# Altium project sensor_board.PrjPcb
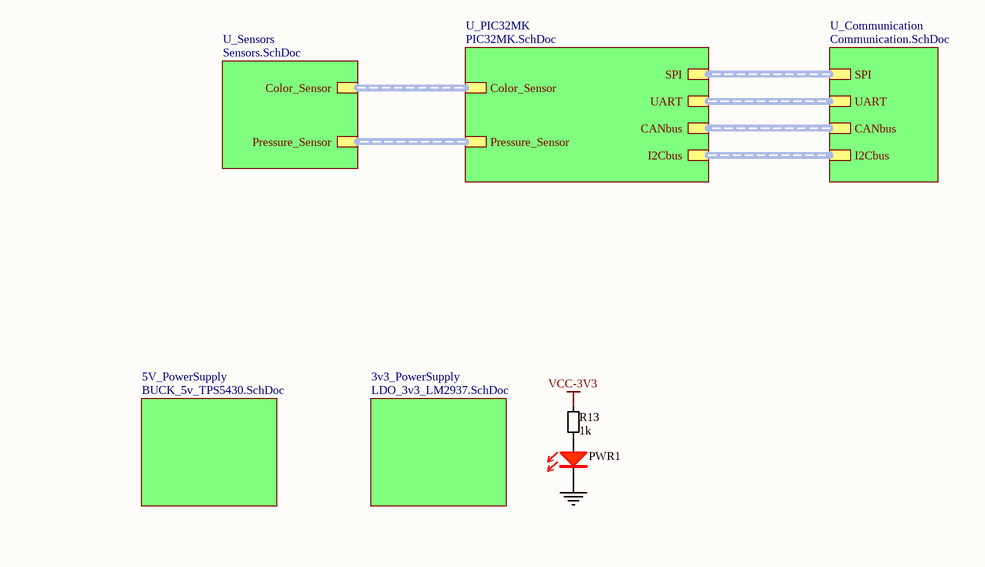
[diagram p0: SensorControl_Board_v3.1.SchDoc]
11 sheets, 107 parts. Net scope: hierarchical (ports join the sheet entries above them; power ports are global).
Board file: SensorControl_Board_v3.1.PcbDoc
Sheets:
  SensorControl_Board_v3.1.SchDoc
    5V_PowerSupply = BUCK_5v_TPS5430.SchDoc
    3v3_PowerSupply = LDO_3v3_LM2937.SchDoc
    U_Communication = Communication.SchDoc
      CANbus = CANbus.SchDoc
    U_Sensors = Sensors.SchDoc
      Col_Sens1 = Color_Sensor.SchDoc
      Col_Sens2 = Color_Sensor.SchDoc
      Col_Sens3 = Color_Sensor.SchDoc
      Col_Sens4 = Color_Sensor.SchDoc
      Col_Sens5 = Color_Sensor.SchDoc
      Pressure_Sensor1 = Pressure_Sensor.SchDoc
      Pressure_Sensor2 = Pressure_Sensor.SchDoc
      Pressure_Sensor3 = Pressure_Sensor.SchDoc
      Pressure_Sensor4 = Pressure_Sensor.SchDoc
      Pressure_Sensor5 = Pressure_Sensor.SchDoc
      Pressure_Sensor6 = Pressure_Sensor.SchDoc
      Pressure_Sensor7 = Pressure_Sensor.SchDoc
      Pressure_Sensor8 = Pressure_Sensor.SchDoc
      Pressure_Sensor9 = Pressure_Sensor.SchDoc
      Pressure_Sensor10 = Pressure_Sensor.SchDoc
    U_PIC32MK = PIC32MK.SchDoc
      Oscillator = 8MHz_Crystal.SchDoc
      RESET = MCLR_PIC.SchDoc

## Sheet SensorControl_Board_v3.1.SchDoc
size A

### Parts
PWR1  LED RED  [LED_RED_0805]  (value not drawn)
R13  1k  [RESC2013X38N-0805-NOOVERLAY]

### Sub-sheets
3v3_PowerSupply = LDO_3v3_LM2937.SchDoc: no entries
5V_PowerSupply = BUCK_5v_TPS5430.SchDoc: no entries
U_Communication = Communication.SchDoc: SPI (harness SPI), UART (harness UART), CANbus (harness CANbus), I2Cbus (harness I2Cbus)
U_PIC32MK = PIC32MK.SchDoc: Color_Sensor (harness Color_Sensor), Pressure_Sensor (harness Pressure_Sensor), SPI (harness SPI), UART (harness UART), CANbus (harness CANbus), I2Cbus (harness I2Cbus)
U_Sensors = Sensors.SchDoc: Color_Sensor (harness Color_Sensor), Pressure_Sensor (harness Pressure_Sensor)

### Nets
GND: PWR1.1(C)
VCC-3V3: R13.2
NetPWR1_2: PWR1.2(A) R13.1

### Buses and harness runs
harness sheet U_Communication/CANbus = sheet U_PIC32MK/CANbus
harness sheet U_Communication/I2Cbus = sheet U_PIC32MK/I2Cbus
harness sheet U_Communication/SPI = sheet U_PIC32MK/SPI
harness sheet U_Communication/UART = sheet U_PIC32MK/UART
harness sheet U_PIC32MK/Color_Sensor = sheet U_Sensors/Color_Sensor
harness sheet U_PIC32MK/Pressure_Sensor = sheet U_Sensors/Pressure_Sensor

### Library data of the parts
PWR1 = LED_RED_0805: LED RED 0805; Manufacturer: BRIGHT LED ELECTRONICS; Manufacturer Part Number: BL-HUB35A-AV-TRB; Barcode: 2911010024321; id: 35; Assembly: SMD; Voltage Forward: 2.0 V; item_id: 3341; Recommended Rating: Platinum; Package Case: 0805 (2012 Metric); Color: Red; Family: LED; Part Type: Optoelectronics
R13 = 00001001: RES SMD 1 kOhm 1/8W 0805; Power: 0.125W, 1/8W; Barcode: 00009101; Resistance: 1k; Assembly: SMD

## Sheet BUCK_5v_TPS5430.SchDoc: Memristor Power 5.0
size A4; Author: Nikola Rašević; Organization: Memristor-Robotics; Address1: Vladimira Perića Valtera 2; Address2: 21000 Novi Sad; Address3: Serbia; Revision: v1
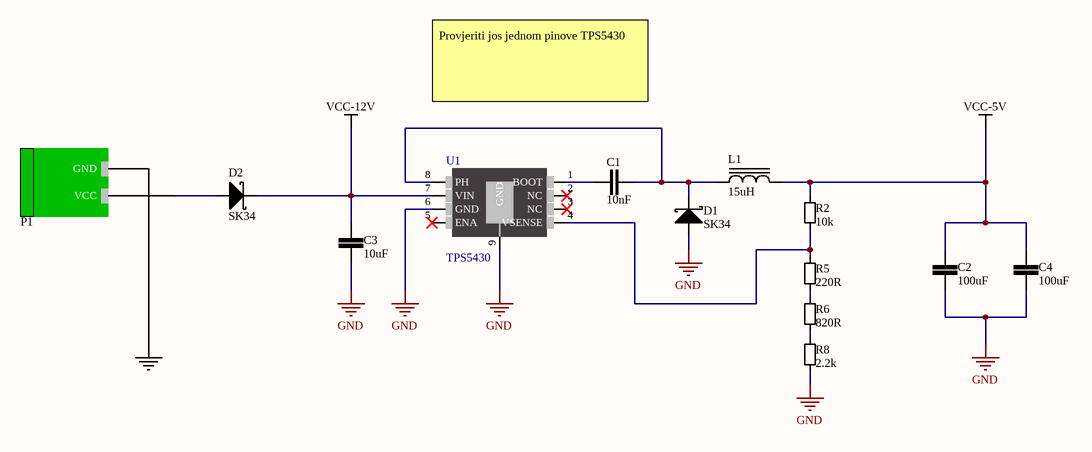
[diagram p1: BUCK_5v_TPS5430.SchDoc]

### Parts
C1  10nF  [CER_0805]
C2  100uF  [CER_1210]
C3  10uF  [CER_0805]
C4  100uF  [CER_1210]
D1  SK34  [DO214AC]
D2  SK34  [DO214AC]
L1  15uH  [INDUCTOR_SS1260-103MLD]
P1  2EDGRC-5.08-02P-14-00A(H)  [PWR_Con]  (value not drawn)
R2  10k  [RESC2013X38N-0805-NOOVERLAY]
R5  220R  [RESC2013X38N-0805-NOOVERLAY]
R6  820R  [RESC2013X38N-0805-NOOVERLAY]
R8  2.2k  [RESC2013X38N-0805-NOOVERLAY]
U1  TPS5430  [HSOP-8]

### Nets
GND: C2.1 C3.1 C4.1 D1.2(Anode) P1.1(GND) R8.1 U1.6(GND) U1.9(GND)
VCC-5V: C2.2 C4.2 L1.2 R2.2
VCC-12V: C3.2 D2.1(Cathode) U1.7(VIN)
NetC1_1: C1.1 U1.1(BOOT)
NetC1_2: C1.2 D1.1(Cathode) L1.1 U1.8(PH)
NetD2_2: D2.2(Anode) P1.2(VCC)
NetR2_1: R2.1 R5.2 U1.4(VSENSE)
NetR5_1: R5.1 R6.2
NetR6_1: R6.1 R8.2

Not connected (* = marked no-connect by the designer): U1 2(NC)* 3(NC)* 5(ENA)*

### Notes on the sheet
- Provjeriti jos jednom pinove TPS5430
- Title
- Date:
- Design Engineer:
- Time:
- Revision:
- Sheet
- of
- Size:
- A4
- www.memristor-robotics.io
- File:

### Library data of the parts
C1 = CER 10n 50V X7R: CAP CER 10n 50V X7R 10% 0805; Capacitance: 10nF; LCSC Part #: C1710
C2 C4 = 00002108: CAP CER 100u X5R 6.3V 10% 1210; Capacitance: 100uF
C3 = CER 10u 25V X5R: CAP CER 10u 25V X5R 10% 0805; Capacitance: 10uF; LCSC Part #: C15850
D1 D2 = SK34: DIODE SCHOTTKY 40V 3A DO214AC; Manufacturer: Vishay Semiconductor Diodes Division; Barcode: 0100000007488; id: 62; Assembly: SMD; Speed: Fast Recovery =< 500ns, > 200mA (Io); Voltage  Forward: 550mV @ 3A; item_id: 1025; Recommended Rating: Silver; Manufacturer Part Number: SK34; Category: Discrete Semiconductor Products; Datasheet URL: http://www.vishay.com/docs/88896/b330la.pdf; Package Case: DO-214AC, SMA; Family: DIODE; Voltage  DC Reverse: 40V; Current  Average Rectified: 3A; Diode Type: Schottky; Part Type: Discrete Semiconductors
L1 = IND_15uH: FIXED IND 15uH 3A; Assembly: SMD; Category: Inductors, Coils, Chokes; Inductance: 15uH; Current Rating: 3A; Family: INDUCTOR
P1 = 00000002: TERM BLOCK HDR 2POS 90DEG 5.08MM; Suplier: TME; Manufacturer Part Number: 2EDGRC-5.08-02P-14-00A(H); Suplier Product Link: https://www.tme.eu/en/details/2edgrc5.08-2p14/pluggable-terminal-blocks/degson-electronics/2edgrc-508-02p-14-00ah/; Price: 0.1304
R2 = 000001002: RES SMD 10 kOhm 1/8W 0805; Resistance: 10k
R5 = RES SMD 220 Ohm 0805: RES SMD 220 Ohm 1/8W 0805; Resistance: 220R; LCSC Part #: C17557
R6 = RES SMD 820 Ohm 0805: RES SMD 820 Ohm 1/8W 0805; Resistance: 820R; LCSC Part #: C17837
R8 = RES SMD 2.2 kOhm 0805: RES SMD 2.2 kOhm 1/8W 0805; Resistance: 2.2k; LCSC Part #: C17520
U1 = TPS5430: IC REG BUCK ADJ 3A 8SOPWRPAD; Manufacturer Part Number: TPS5430; LCSC Part #: C9864

## Sheet LDO_3v3_LM2937.SchDoc: 3v3 LDO Module
size A4; Author: Nikola Raševiæ; Organization: Memristor Robotics; SheetNumber: 2; SheetTotal: 11
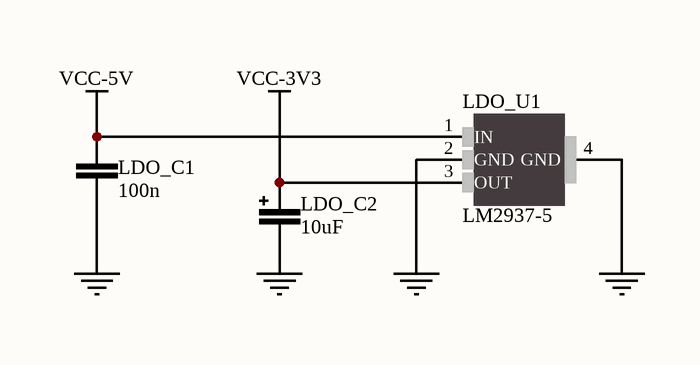
[diagram p2: LDO_3v3_LM2937.SchDoc]

### Parts
LDO_C1  100n  [CER_0603]
LDO_C2  10uF  [TANT_1210]
LDO_U1  LM2937-5  [SOT223]

### Nets
GND: LDO_C1.1 LDO_C2.2 LDO_U1.2(GND) LDO_U1.4(GND)
VCC-3V3: LDO_C2.1 LDO_U1.3(OUT)
VCC-5V: LDO_C1.2 LDO_U1.1(IN)

### Notes on the sheet
- Title
- Date:
- Design Engineer:
- Time:
- Revision:
- Sheet
- of
- Size:
- A4
- www.memristor-robotics.io
- File:

### Library data of the parts
LDO_C1 = 06032105: CAP CER 100n 10V X5R 10% 0603; Capacitance: 100n
LDO_C2 = 00001106: CAP TANT 10u; Value: 10uF
LDO_U1 = LM2937: IC REG LINEAR 5V 400MA SOT223-4; Manufacturer Part Number: LM2937-5; Datasheet Link: http://www.ti.com/lit/ds/symlink/lm2937.pdf

## Sheet Communication.SchDoc
size A4
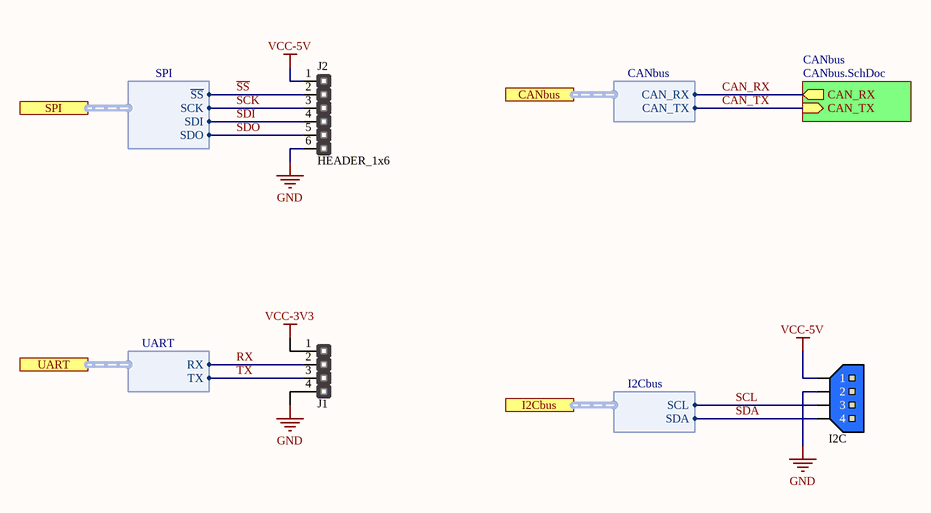
[diagram p3: Communication.SchDoc]

### Parts
I2C  TE CONNECTIVITY_4PIN_MALE  [TE CONNECTIVITY_4PIN_MALE]  (value not drawn)
J1  HEADER_1x4  [HM1X4]  (value not drawn)
J2  HEADER_1x6  [HM1X6]

### Sub-sheets
CANbus = CANbus.SchDoc: CAN_TX (in), CAN_RX (out)

### Ports
CANbus (harness CANbus), I2Cbus (harness I2Cbus), SPI (harness SPI), UART (harness UART)

### Harnesses
SPI: ~{SS}, SCK, SDI, SDO
UART: RX, TX
CANbus: CAN_RX, CAN_TX
I2Cbus: SCL, SDA

### Nets
GND: I2C.2 J1.4 J2.6
VCC-3V3: J1.1
VCC-5V: I2C.1 J2.1
CAN_RX: sheet CANbus/CAN_RX, port CANbus.CAN_RX
CAN_TX: sheet CANbus/CAN_TX, port CANbus.CAN_TX
RX: J1.2 ; port UART.RX
~{SS}: J2.2 ; port SPI.~{SS}
SCK: J2.3 ; port SPI.SCK
SCL: I2C.3 ; port I2Cbus.SCL
SDA: I2C.4 ; port I2Cbus.SDA
SDI: J2.4 ; port SPI.SDI
SDO: J2.5 ; port SPI.SDO
TX: J1.3 ; port UART.TX

### Library data of the parts
I2C = TE CONNECTIVITY_4PIN_MALE: BLUE_4PIN_CONECTOR; Manufacturer: TE CONNECTIVITY / AMP; Manufacturer Part Number 1: 281695-3; Order Code 1: 1205983; Price 1: L0.403; Supplier 1: uk.farnell.com

## Sheet CANbus.SchDoc: CANbus Module
size A4; Author: Nikola Rašević; Organization: Memristor Robotics
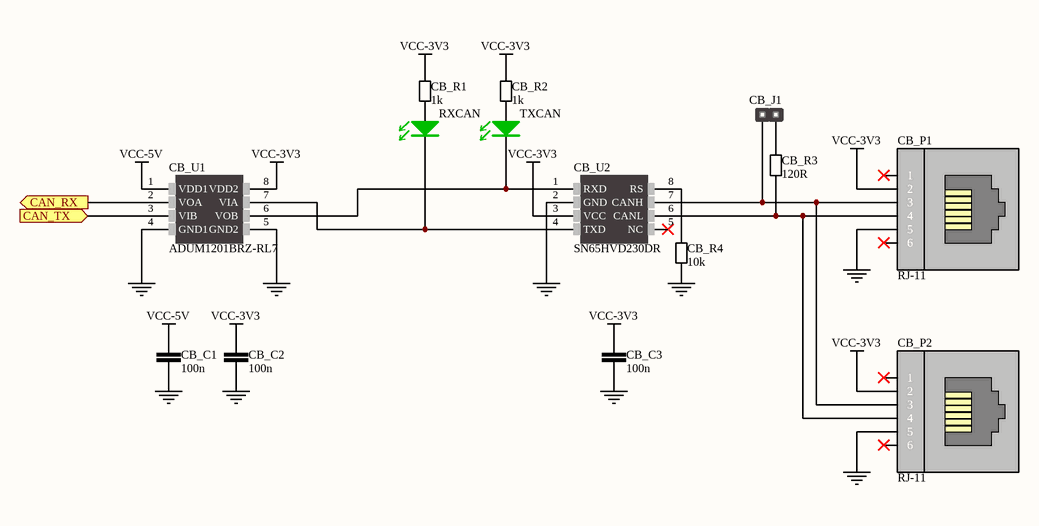
[diagram p4: CANbus.SchDoc]

### Parts
CB_C1  100n  [CER_0603]
CB_C2  100n  [CER_0603]
CB_C3  100n  [CER_0603]
CB_J1  *  [HM1x2]  (value not drawn)
CB_P1  RJ-11  [RJ11-6N-B]
CB_P2  RJ-11  [RJ11-6N-B]
CB_R1  1k  [RESC2013X38N-0805-NOOVERLAY]
CB_R2  1k  [RESC2013X38N-0805-NOOVERLAY]
CB_R3  120R  [RESC2013X38N-0805-NOOVERLAY]
CB_R4  10k  [RESC2013X38N-0805-NOOVERLAY]
CB_U1  ADUM1201BRZ-RL7  [SOIC-8]
CB_U2  SN65HVD230DR  [SOIC-8]
RXCAN  LED GREEN  [LED_GREEN_0805]  (value not drawn)
TXCAN  LED GREEN  [LED_GREEN_0805]  (value not drawn)

### Ports
CAN_RX (out), CAN_TX (in)

### Nets
GND: CB_C1.1 CB_C2.1 CB_C3.1 CB_P1.5 CB_P2.5 CB_R4.1 CB_U1.4(GND1) CB_U1.5(GND2) CB_U2.2(GND)
VCC-3V3: CB_C2.2 CB_C3.2 CB_P1.2 CB_P2.2 CB_R1.2 CB_R2.2 CB_U1.8(VDD2) CB_U2.3(VCC)
VCC-5V: CB_C1.2 CB_U1.1(VDD1)
CAN_RX: CB_U1.2(VOA) ; port CAN_RX
CAN_TX: CB_U1.3(VIB) ; port CAN_TX
NetCB_J1_1: CB_J1.1 CB_P1.3 CB_P2.3 CB_U2.7(CANH)
NetCB_J1_2: CB_J1.2 CB_R3.2
NetCB_P1_4: CB_P1.4 CB_P2.4 CB_R3.1 CB_U2.6(CANL)
NetCB_R1_1: CB_R1.1 RXCAN.2(A)
NetCB_R2_1: CB_R2.1 TXCAN.2(A)
NetCB_R4_2: CB_R4.2 CB_U2.8(RS)
NetCB_U1_6: CB_U1.6(VOB) CB_U2.1(RXD) TXCAN.1(C)
NetCB_U1_7: CB_U1.7(VIA) CB_U2.4(TXD) RXCAN.1(C)

Not connected (* = marked no-connect by the designer): CB_P1 1* 6*; CB_P2 1* 6*; CB_U2 5(NC)*

### Notes on the sheet
- Title
- Date:
- Design Engineer:
- Time:
- Revision:
- Sheet
- of
- Size:
- A4
- www.memristor-robotics.io
- File:

### Library data of the parts
CB_C1-CB_C3 = 06032105: CAP CER 100n 10V X5R 10% 0603; Capacitance: 100n
CB_J1 = HEADER_1x2: Manufacturer Part Number: *
CB_P1 CB_P2 = 00000001: Manufacturer Part Number: RJ-11
CB_R1 CB_R2 = 00001001: as R13 on sheet SensorControl_Board_v3.1; Resistance: 1k; Assembly: SMD
CB_R3 = 000001200: RES SMD 120 Ohm 1/8W 0805; Resistance: 120R
CB_R4 = 000001002: RES SMD 10 kOhm 1/8W 0805; Resistance: 10k
CB_U1 = ADUM1201BRZ: DGTL ISO 2.5KV GEN PURP 8SOIC; Assembly: SMD; Barcode: 00000001; Manufacturer Part Number: ADUM1201BRZ-RL7; Datasheet Link: http://www.analog.com/media/en/technical-documentation/data-sheets/ADuM1200_1201.pdf; Category: Integrated Circuits (ICs); Package: SOIC-8; Family: Comunication
CB_U2 = SN65HVD230: IC EMC CAN TRANSCEIVER 8-SOIC; Assembly: SMD; Barcode: 00000001; Manufacturer Part Number: SN65HVD230DR; Comet Product Page: http://store.comet.rs/Catalogue/Product/9057/; Datasheet Link: http://www.ti.com/lit/ds/symlink/sn65hvd232.pdf; Category: Integrated Circuits (ICs); Package: SOIC-8; Family: Comunication
RXCAN TXCAN = LED_GREEN 0805: LED GREEN CLEAR 0805 SMD; Manufacturer: Kingbright; Manufacturer Part Number: APT2012SGC; Barcode: 2911010024338; id: 28; Voltage Forward: 2.2V; Wavelength: 568nm; Lens Color: Colorless; item_id: 3342; Recommended Rating: Platinum; Category: Optoelectronics; Assembly: SMD; Datasheet URL: http://www.kingbrightusa.com/images/catalog/SPEC/APT2012SGC.pdf; Package Case: 0805 (2012 Metric); Color: Green; Family: LED; Lens Transparency: Clear; Part Type: Optoelectronics

## Sheet Sensors.SchDoc
size A4
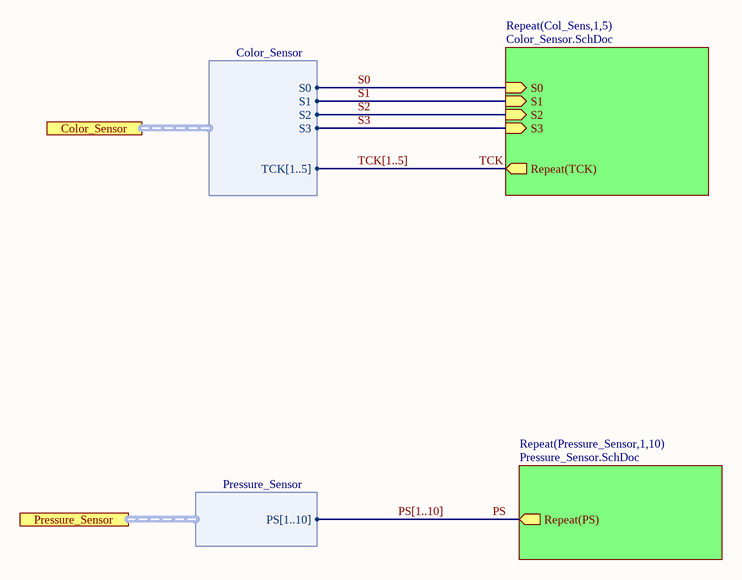
[diagram p5: Sensors.SchDoc]

### Sub-sheets
Repeat(Col_Sens,1,5) = Color_Sensor.SchDoc: S0 (in), S1 (in), S2 (in), S3 (in), Repeat(TCK) (out)
Repeat(Pressure_Sensor,1,10) = Pressure_Sensor.SchDoc: Repeat(PS) (out)

### Ports
Color_Sensor (harness Color_Sensor), Pressure_Sensor (harness Pressure_Sensor)

### Harnesses
Color_Sensor: TCK[1..5], S0, S1, S2, S3
Pressure_Sensor: PS[1..10]

### Nets
PS: sheet Repeat(Pressure_Sensor,1,10)/Repeat(PS)
S0: sheet Repeat(Col_Sens,1,5)/S0, port Color_Sensor.S0
S1: sheet Repeat(Col_Sens,1,5)/S1, port Color_Sensor.S1
S2: sheet Repeat(Col_Sens,1,5)/S2, port Color_Sensor.S2
S3: sheet Repeat(Col_Sens,1,5)/S3, port Color_Sensor.S3
TCK: sheet Repeat(Col_Sens,1,5)/Repeat(TCK)

### Buses and harness runs
bus PS[1..10]
bus TCK[1..5]

## Sheet Color_Sensor.SchDoc
size A
Used 5 times, as channels U_Sensors/Col_Sens1, U_Sensors/Col_Sens2, U_Sensors/Col_Sens3, U_Sensors/Col_Sens4, U_Sensors/Col_Sens5. Parts and nets are listed once, with the designators drawn on the sheet.
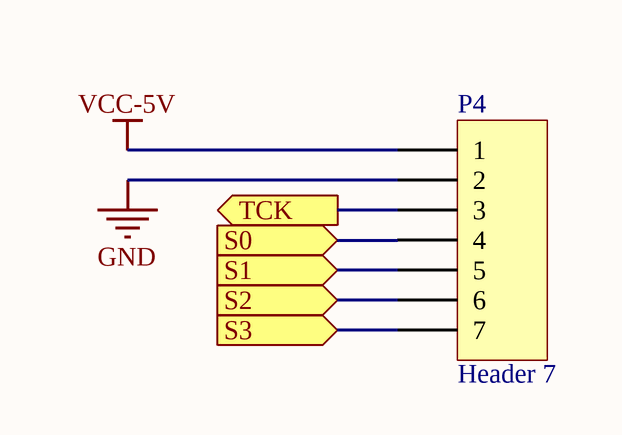
[diagram p6: Color_Sensor.SchDoc]

### Parts
P4  Header 7  [HDR1X7]

### Ports
S0 (in), S1 (in), S2 (in), S3 (in), TCK (out)

### Nets
GND: P4.2
VCC-5V: P4.1
S0: P4.4 ; port S0
S1: P4.5 ; port S1
S2: P4.6 ; port S2
S3: P4.7 ; port S3
TCK: P4.3 ; port TCK

### Channels
U_Sensors/Col_Sens1: designators end in _Col_Sens1; ports S0=S0 S1=S1 S2=S2 S3=S3 TCK=TCK1
U_Sensors/Col_Sens2: designators end in _Col_Sens2; ports S0=S0 S1=S1 S2=S2 S3=S3 TCK=TCK2
U_Sensors/Col_Sens3: designators end in _Col_Sens3; ports S0=S0 S1=S1 S2=S2 S3=S3 TCK=TCK3
U_Sensors/Col_Sens4: designators end in _Col_Sens4; ports S0=S0 S1=S1 S2=S2 S3=S3 TCK=TCK4
U_Sensors/Col_Sens5: designators end in _Col_Sens5; ports S0=S0 S1=S1 S2=S2 S3=S3 TCK=TCK5

### Library data of the parts
P4 = Header 7: Header, 7-Pin; LatestRevisionDate: 17-Jul-2002; LatestRevisionNote: Re-released for DXP Platform.; Publisher: Altium Limited

## Sheet Pressure_Sensor.SchDoc
size A4; SheetNumber: 11; SheetTotal: 11
Used 10 times, as channels U_Sensors/Pressure_Sensor1, U_Sensors/Pressure_Sensor2, U_Sensors/Pressure_Sensor3, U_Sensors/Pressure_Sensor4, U_Sensors/Pressure_Sensor5, U_Sensors/Pressure_Sensor6, U_Sensors/Pressure_Sensor7, U_Sensors/Pressure_Sensor8, U_Sensors/Pressure_Sensor9, U_Sensors/Pressure_Sensor10. Parts and nets are listed once, with the designators drawn on the sheet.
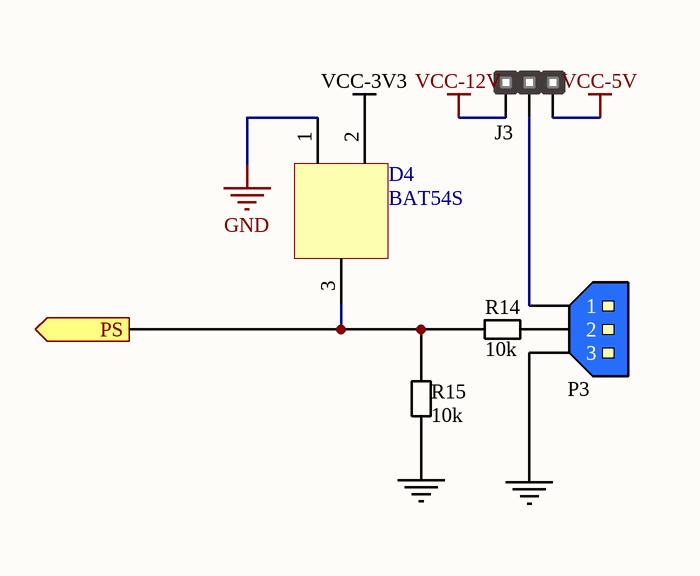
[diagram p7: Pressure_Sensor.SchDoc]

### Parts
D4  BAT54S  [BAT54S]
J3  *  [HM1X3]  (value not drawn)
P3  TE CONNECTIVITY_3PIN_MALE  [TE CONNECTIVITY_3PIN_MALE]  (value not drawn)
R14  10k  [RESC2013X38N-0805-NOOVERLAY]
R15  10k  [RESC2013X38N-0805-NOOVERLAY]

### Ports
PS (out)

### Nets
GND: D4.1 P3.3 R15.1
VCC-3V3: D4.2
VCC-5V: J3.3
VCC-12V: J3.1
PS: D4.3 R14.2 R15.2 ; port PS
NetJ3_2: J3.2 P3.1
NetP3_2: P3.2 R14.1

### Channels
U_Sensors/Pressure_Sensor1: designators end in _Pressure_Sensor1; ports PS=PS1
U_Sensors/Pressure_Sensor2: designators end in _Pressure_Sensor2; ports PS=PS2
U_Sensors/Pressure_Sensor3: designators end in _Pressure_Sensor3; ports PS=PS3
U_Sensors/Pressure_Sensor4: designators end in _Pressure_Sensor4; ports PS=PS4
U_Sensors/Pressure_Sensor5: designators end in _Pressure_Sensor5; ports PS=PS5
U_Sensors/Pressure_Sensor6: designators end in _Pressure_Sensor6; ports PS=PS6
U_Sensors/Pressure_Sensor7: designators end in _Pressure_Sensor7; ports PS=PS7
U_Sensors/Pressure_Sensor8: designators end in _Pressure_Sensor8; ports PS=PS8
U_Sensors/Pressure_Sensor9: designators end in _Pressure_Sensor9; ports PS=PS9
U_Sensors/Pressure_Sensor10: designators end in _Pressure_Sensor10; ports PS=PS10

### Library data of the parts
J3 = HEADER_1x3: Manufacturer Part Number: *
P3 = TE CONNECTIVITY_3PIN_MALE: BLUE_3PIN_CONECTOR; Manufacturer: TE CONNECTIVITY / AMP; Manufacturer Part Number 1: 281695-3; Order Code 1: 1205983; Price 1: £0.403; Supplier 1: uk.farnell.com
R14 R15 = 000001002: RES SMD 10 kOhm 1/8W 0805; Resistance: 10k

## Sheet PIC32MK.SchDoc
size A3
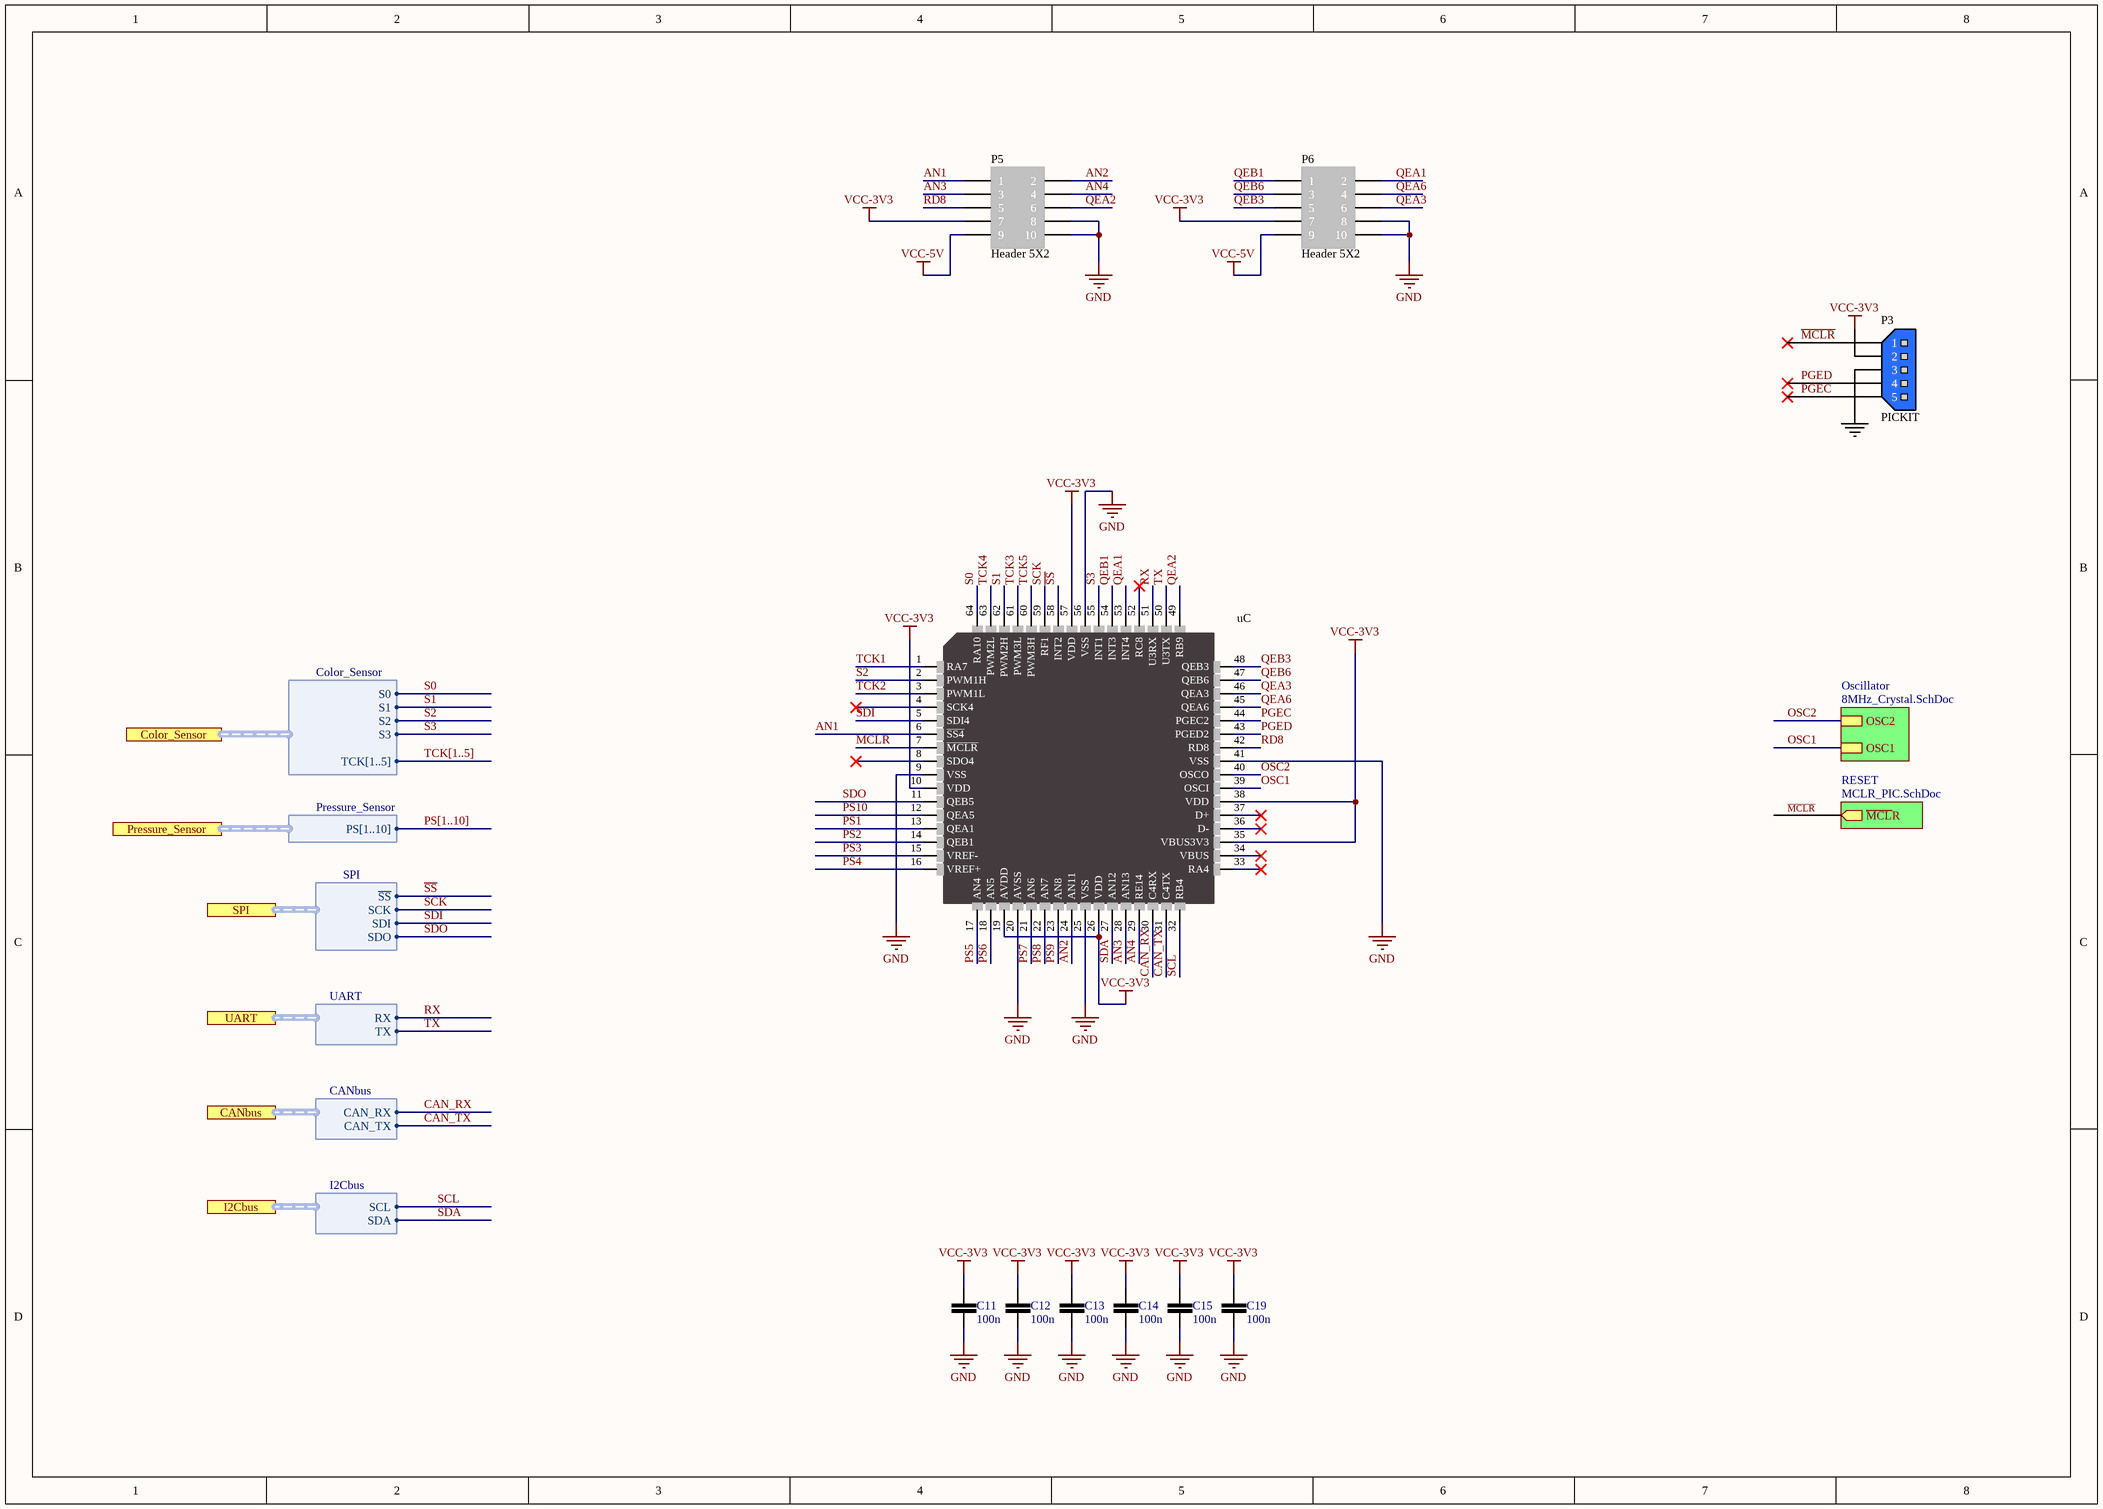
[diagram p8: PIC32MK.SchDoc]

### Parts
C11  100n  [CER_0805]
C12  100n  [CER_0805]
C13  100n  [CER_0805]
C14  100n  [CER_0805]
C15  100n  [CER_0805]
C19  100n  [CER_0805]
P3  PICKIT  [TE CONNECTIVITY_5PIN_MALE]
P5  Header 5X2  [CONNECTOR_2X5]
P6  Header 5X2  [CONNECTOR_2X5]
uC  (no value)  [TQFP-64-500um]

### Sub-sheets
Oscillator = 8MHz_Crystal.SchDoc: OSC1, OSC2
RESET = MCLR_PIC.SchDoc: ~{MCL}R (out)

### Ports
CANbus (harness CANbus), Color_Sensor (harness Color_Sensor), I2Cbus (harness I2Cbus), Pressure_Sensor (harness Pressure_Sensor), SPI (harness SPI), UART (harness UART)

### Harnesses
Color_Sensor: TCK[1..5], S0, S1, S2, S3
Pressure_Sensor: PS[1..10]
SPI: ~{SS}, SCK, SDI, SDO
UART: RX, TX
CANbus: CAN_RX, CAN_TX
I2Cbus: SCL, SDA

### Nets
GND: C11.1 C12.1 C13.1 C14.1 C15.1 C19.1 P3.3 P5.8 P5.10 P6.8 P6.10 uC.9(VSS) uC.20(AVSS) uC.25(VSS) uC.41(VSS) uC.56(VSS)
VCC-3V3: C11.2 C12.2 C13.2 C14.2 C15.2 C19.2 P3.2 P5.7 P6.7 uC.10(VDD) uC.19(AVDD) uC.26(VDD) uC.35(VBUS3V3) uC.38(VDD) uC.57(VDD)
VCC-5V: P5.9 P6.9
AN1: P5.1 uC.6(~{SS4})
AN2: P5.2 uC.24(AN11)
AN3: P5.3 uC.28(AN13)
AN4: P5.4 uC.29(RE14)
CAN_RX: uC.30(C4RX) ; port CANbus.CAN_RX
CAN_TX: uC.31(C4TX) ; port CANbus.CAN_TX
~{MCLR}: P3.1 uC.7(~{MCLR}) ; sheet RESET/~{MCL}R
OSC1: uC.39(OSCI) ; sheet Oscillator/OSC1
OSC2: uC.40(OSCO) ; sheet Oscillator/OSC2
PGEC: P3.5 uC.44(PGEC2)
PGED: P3.4 uC.43(PGED2)
PS1: uC.13(QEA1)
PS2: uC.14(QEB1)
PS3: uC.15(VREF-)
PS4: uC.16(VREF+)
PS5: uC.17(AN4)
PS6: uC.18(AN5)
PS7: uC.21(AN6)
PS8: uC.22(AN7)
PS9: uC.23(AN8)
PS10: uC.12(QEA5)
QEA1: P6.2 uC.53(INT4)
QEA2: P5.6 uC.49(RB9)
QEA3: P6.6 uC.46(QEA3)
QEA6: P6.4 uC.45(QEA6)
QEB1: P6.1 uC.54(INT3)
QEB3: P6.5 uC.48(QEB3)
QEB6: P6.3 uC.47(QEB6)
RD8: P5.5 uC.42(RD8)
RX: uC.51(U3RX) ; port UART.RX
S0: uC.64(RA10) ; port Color_Sensor.S0
S1: uC.62(PWM2H) ; port Color_Sensor.S1
S2: uC.2(PWM1H) ; port Color_Sensor.S2
S3: uC.55(INT1) ; port Color_Sensor.S3
~{SS}: uC.58(INT2) ; port SPI.~{SS}
SCK: uC.59(RF1) ; port SPI.SCK
SCL: uC.32(RB4) ; port I2Cbus.SCL
SDA: uC.27(AN12) ; port I2Cbus.SDA
SDI: uC.5(SDI4) ; port SPI.SDI
SDO: uC.11(QEB5) ; port SPI.SDO
TCK1: uC.1(RA7)
TCK2: uC.3(PWM1L)
TCK3: uC.61(PWM3L)
TCK4: uC.63(PWM2L)
TCK5: uC.60(PWM3H)
TX: uC.50(U3TX) ; port UART.TX

Not connected (* = marked no-connect by the designer): uC 4(SCK4)* 8(SDO4)* 33(RA4)* 34(VBUS)* 36(D-)* 37(D+)* 52(RC8)*

### Buses and harness runs
bus PS[1..10]
bus TCK[1..5]

### Notes on the sheet
- (in symbol PIC32MK) RF1; RC8; RA10; INT2; VDD; VSS; INT1; INT3; INT4; RB9; U3RX; U3TX; PWM2L; PWM2H; PWM3L; PWM3H; RA7; QEB3; PWM1H; QEB6; PWM1L; QEA3; SCK4; QEA6; SDI4; PGEC2; SS4; PGED2; MCLR; RD8/VBAT; SDO4; OSC0; OSC1; QEB5; QEA5; D+; QEA1; D-; QEB1; VBUS3V3; VREF-; VBUS; VREF+; RA4; AN4; AN5; AVDD; AVSS; AN6; AN7; AN8; AN11; AN12; AN13; RE14; C4RX; C4TX; RB4

### Library data of the parts
C11-C15 C19 = 0100000001868: Manufacturer: Yageo; Manufacturer Part Number: CC0805KRX7R9BB104; id: 136; Assembly: SMD; Temperature Coefficient: X7R; Tolerance: 10%; Voltage Rated: 50; item_id: 450; Recommended Rating: Platinum; Barcode: 0100000001868; Category: Capacitors; Capacitance: 100n; Package Case: 0805; Family: CERAMIC CAPACITOR; Part Type: Capacitors
P3 = TE CONNECTIVITY_5PIN_MALE: BLUE_5PIN_CONECTOR; Manufacturer: TE CONNECTIVITY / AMP; Manufacturer Part Number 1: 281695-3; Order Code 1: 1205983; Price 1: £0.403; Supplier 1: uk.farnell.com
P5 P6 = Header 5X2: Header, 5-Pin, Dual row; LatestRevisionDate: 17-Jul-2002; LatestRevisionNote: Re-released for DXP Platform.; Publisher: Altium Limited
uC = PIC32MK1024MCF064: IC MCU 32BIT 1MB FLASH 64TQFP; Manufacturer Part Number: PIC32MK1024MCF064

## Sheet 8MHz_Crystal.SchDoc: 8MHz Crystal Oscillator Module
size A4; Author: Nikola Rašević; Organization: Memristor Robotics
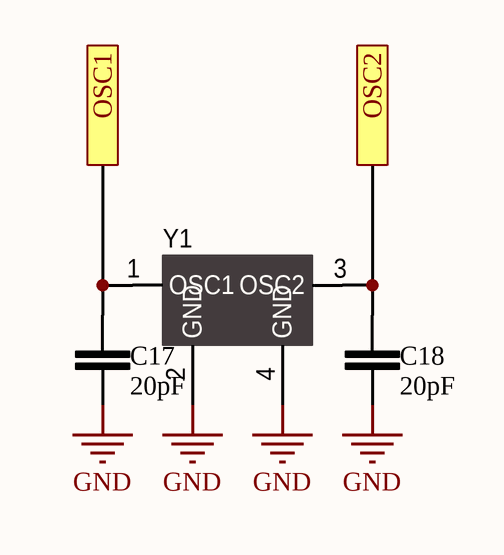
[diagram p9: 8MHz_Crystal.SchDoc]

### Parts
C17  20pF  [CER_0603]
C18  20pF  [CER_0603]
Y1  8Hz  [ABM10]  (value not drawn)

### Ports
OSC1, OSC2

### Nets
GND: C17.1 C18.1 Y1.2(GND) Y1.4(GND)
OSC1: C17.2 Y1.1(OSC1) ; port OSC1
OSC2: C18.2 Y1.3(OSC2) ; port OSC2

### Notes on the sheet
- Title
- Date:
- Design Engineer:
- Time:
- Revision:
- Sheet
- of
- Size:
- A4
- www.memristor-robotics.io
- File:

### Library data of the parts
C17 C18 = 00002200: CAP CER 20p 0805; Capacitance: 20pF
Y1 = QUARTZ_8MHz: CRYSTAL 8.0000MHZ 18PF SMD; Manufacturer: ABRACON; Manufacturer Part Number: ABMM2-8.000MHZ-E2-T; id: 17; Frequency Stability: ±30ppm; Equivalent Series Resistance: 72 Ohm; item_id: 4360; Category: Crystals and Oscillators; Assembly: SMD; Datasheet URL: http://www.abracon.com/Resonators/ABMM2.pdf; Package Case: 4-SMD, No Lead (DFN, LCC); Frequency: 8Hz; Frequency Tolerance: ±30ppm; Load Capacitance: 18pF; Family: CRYSTAL; Size Dimension: 0.126" L x 0.098" W (3.20mm x 2.50mm); Part Type: Crystals, Oscillators

## Sheet MCLR_PIC.SchDoc
size A4
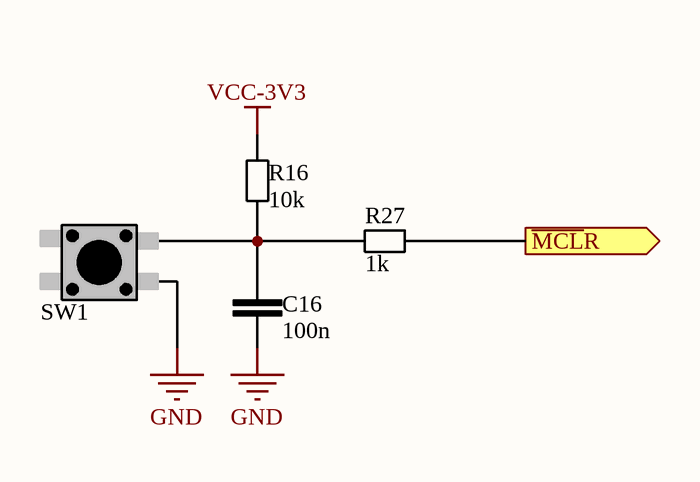
[diagram p10: MCLR_PIC.SchDoc]

### Parts
C16  100n  [CER_0603]
R16  10k  [RESC2013X38N-0805-NOOVERLAY]
R27  1k  [RESC2013X38N-0805-NOOVERLAY]
SW1  TASTER  [TASTER_SMD]  (value not drawn)

### Ports
~{MCL}R (out)

### Nets
GND: C16.1 SW1.1
VCC-3V3: R16.2
~{MCLR}: R27.2 ; port ~{MCL}R
NetC16_2: C16.2 R16.1 R27.1 SW1.2

### Notes on the sheet
- Title
- Date:
- Design Engineer:
- Time:
- Revision:
- Sheet
- of
- Size:
- A4
- www.memristor-robotics.io
- File:

### Library data of the parts
C16 = 06032105: CAP CER 100n 10V X5R 10% 0603; Capacitance: 100n
R16 = 000001002: RES SMD 10 kOhm 1/8W 0805; Resistance: 10k
R27 = 00001001: as R13 on sheet SensorControl_Board_v3.1; Resistance: 1k; Assembly: SMD

## Nets that join several sheets
GND: SensorControl_Board_v3.1 (PWR1.1), BUCK_5v_TPS5430 (8 pins), LDO_3v3_LM2937 (LDO_C1.1 LDO_C2.2 LDO_U1.2 LDO_U1.4), Communication (I2C.2 J1.4 J2.6), CANbus (9 pins), U_Sensors/Col_Sens1 (P4_Col_Sens1.2), U_Sensors/Col_Sens2 (P4_Col_Sens2.2), U_Sensors/Col_Sens3 (P4_Col_Sens3.2), U_Sensors/Col_Sens4 (P4_Col_Sens4.2), U_Sensors/Col_Sens5 (P4_Col_Sens5.2), U_Sensors/Pressure_Sensor1 (D4_Pressure_Sensor1.1 P3_Pressure_Sensor1.3 R15_Pressure_Sensor1.1), U_Sensors/Pressure_Sensor2 (D4_Pressure_Sensor2.1 P3_Pressure_Sensor2.3 R15_Pressure_Sensor2.1), U_Sensors/Pressure_Sensor3 (D4_Pressure_Sensor3.1 P3_Pressure_Sensor3.3 R15_Pressure_Sensor3.1), U_Sensors/Pressure_Sensor4 (D4_Pressure_Sensor4.1 P3_Pressure_Sensor4.3 R15_Pressure_Sensor4.1), U_Sensors/Pressure_Sensor5 (D4_Pressure_Sensor5.1 P3_Pressure_Sensor5.3 R15_Pressure_Sensor5.1), U_Sensors/Pressure_Sensor6 (D4_Pressure_Sensor6.1 P3_Pressure_Sensor6.3 R15_Pressure_Sensor6.1), U_Sensors/Pressure_Sensor7 (D4_Pressure_Sensor7.1 P3_Pressure_Sensor7.3 R15_Pressure_Sensor7.1), U_Sensors/Pressure_Sensor8 (D4_Pressure_Sensor8.1 P3_Pressure_Sensor8.3 R15_Pressure_Sensor8.1), U_Sensors/Pressure_Sensor9 (D4_Pressure_Sensor9.1 P3_Pressure_Sensor9.3 R15_Pressure_Sensor9.1), U_Sensors/Pressure_Sensor10 (D4_Pressure_Sensor10.1 P3_Pressure_Sensor10.3 R15_Pressure_Sensor10.1), PIC32MK (16 pins), 8MHz_Crystal (C17.1 C18.1 Y1.2 Y1.4), MCLR_PIC (C16.1 SW1.1)
VCC-3V3: SensorControl_Board_v3.1 (R13.2), LDO_3v3_LM2937 (LDO_C2.1 LDO_U1.3), Communication (J1.1), CANbus (8 pins), U_Sensors/Pressure_Sensor1 (D4_Pressure_Sensor1.2), U_Sensors/Pressure_Sensor2 (D4_Pressure_Sensor2.2), U_Sensors/Pressure_Sensor3 (D4_Pressure_Sensor3.2), U_Sensors/Pressure_Sensor4 (D4_Pressure_Sensor4.2), U_Sensors/Pressure_Sensor5 (D4_Pressure_Sensor5.2), U_Sensors/Pressure_Sensor6 (D4_Pressure_Sensor6.2), U_Sensors/Pressure_Sensor7 (D4_Pressure_Sensor7.2), U_Sensors/Pressure_Sensor8 (D4_Pressure_Sensor8.2), U_Sensors/Pressure_Sensor9 (D4_Pressure_Sensor9.2), U_Sensors/Pressure_Sensor10 (D4_Pressure_Sensor10.2), PIC32MK (15 pins), MCLR_PIC (R16.2)
VCC-5V: BUCK_5v_TPS5430 (C2.2 C4.2 L1.2 R2.2), LDO_3v3_LM2937 (LDO_C1.2 LDO_U1.1), Communication (I2C.1 J2.1), CANbus (CB_C1.2 CB_U1.1), U_Sensors/Col_Sens1 (P4_Col_Sens1.1), U_Sensors/Col_Sens2 (P4_Col_Sens2.1), U_Sensors/Col_Sens3 (P4_Col_Sens3.1), U_Sensors/Col_Sens4 (P4_Col_Sens4.1), U_Sensors/Col_Sens5 (P4_Col_Sens5.1), U_Sensors/Pressure_Sensor1 (J3_Pressure_Sensor1.3), U_Sensors/Pressure_Sensor2 (J3_Pressure_Sensor2.3), U_Sensors/Pressure_Sensor3 (J3_Pressure_Sensor3.3), U_Sensors/Pressure_Sensor4 (J3_Pressure_Sensor4.3), U_Sensors/Pressure_Sensor5 (J3_Pressure_Sensor5.3), U_Sensors/Pressure_Sensor6 (J3_Pressure_Sensor6.3), U_Sensors/Pressure_Sensor7 (J3_Pressure_Sensor7.3), U_Sensors/Pressure_Sensor8 (J3_Pressure_Sensor8.3), U_Sensors/Pressure_Sensor9 (J3_Pressure_Sensor9.3), U_Sensors/Pressure_Sensor10 (J3_Pressure_Sensor10.3), PIC32MK (P5.9 P6.9)
VCC-12V: BUCK_5v_TPS5430 (C3.2 D2.1 U1.7), U_Sensors/Pressure_Sensor1 (J3_Pressure_Sensor1.1), U_Sensors/Pressure_Sensor2 (J3_Pressure_Sensor2.1), U_Sensors/Pressure_Sensor3 (J3_Pressure_Sensor3.1), U_Sensors/Pressure_Sensor4 (J3_Pressure_Sensor4.1), U_Sensors/Pressure_Sensor5 (J3_Pressure_Sensor5.1), U_Sensors/Pressure_Sensor6 (J3_Pressure_Sensor6.1), U_Sensors/Pressure_Sensor7 (J3_Pressure_Sensor7.1), U_Sensors/Pressure_Sensor8 (J3_Pressure_Sensor8.1), U_Sensors/Pressure_Sensor9 (J3_Pressure_Sensor9.1), U_Sensors/Pressure_Sensor10 (J3_Pressure_Sensor10.1)
CAN_RX: CANbus (CB_U1.2), PIC32MK (uC.30)
CAN_TX: CANbus (CB_U1.3), PIC32MK (uC.31)
~{MCLR}: PIC32MK (P3.1 uC.7), MCLR_PIC (R27.2)
OSC1: PIC32MK (uC.39), 8MHz_Crystal (C17.2 Y1.1)
OSC2: PIC32MK (uC.40), 8MHz_Crystal (C18.2 Y1.3)
PS1: U_Sensors/Pressure_Sensor1 (D4_Pressure_Sensor1.3 R14_Pressure_Sensor1.2 R15_Pressure_Sensor1.2), PIC32MK (uC.13)
PS2: U_Sensors/Pressure_Sensor2 (D4_Pressure_Sensor2.3 R14_Pressure_Sensor2.2 R15_Pressure_Sensor2.2), PIC32MK (uC.14)
PS3: U_Sensors/Pressure_Sensor3 (D4_Pressure_Sensor3.3 R14_Pressure_Sensor3.2 R15_Pressure_Sensor3.2), PIC32MK (uC.15)
PS4: U_Sensors/Pressure_Sensor4 (D4_Pressure_Sensor4.3 R14_Pressure_Sensor4.2 R15_Pressure_Sensor4.2), PIC32MK (uC.16)
PS5: U_Sensors/Pressure_Sensor5 (D4_Pressure_Sensor5.3 R14_Pressure_Sensor5.2 R15_Pressure_Sensor5.2), PIC32MK (uC.17)
PS6: U_Sensors/Pressure_Sensor6 (D4_Pressure_Sensor6.3 R14_Pressure_Sensor6.2 R15_Pressure_Sensor6.2), PIC32MK (uC.18)
PS7: U_Sensors/Pressure_Sensor7 (D4_Pressure_Sensor7.3 R14_Pressure_Sensor7.2 R15_Pressure_Sensor7.2), PIC32MK (uC.21)
PS8: U_Sensors/Pressure_Sensor8 (D4_Pressure_Sensor8.3 R14_Pressure_Sensor8.2 R15_Pressure_Sensor8.2), PIC32MK (uC.22)
PS9: U_Sensors/Pressure_Sensor9 (D4_Pressure_Sensor9.3 R14_Pressure_Sensor9.2 R15_Pressure_Sensor9.2), PIC32MK (uC.23)
PS10: U_Sensors/Pressure_Sensor10 (D4_Pressure_Sensor10.3 R14_Pressure_Sensor10.2 R15_Pressure_Sensor10.2), PIC32MK (uC.12)
RX: Communication (J1.2), PIC32MK (uC.51)
S0: U_Sensors/Col_Sens1 (P4_Col_Sens1.4), U_Sensors/Col_Sens2 (P4_Col_Sens2.4), U_Sensors/Col_Sens3 (P4_Col_Sens3.4), U_Sensors/Col_Sens4 (P4_Col_Sens4.4), U_Sensors/Col_Sens5 (P4_Col_Sens5.4), PIC32MK (uC.64)
S1: U_Sensors/Col_Sens1 (P4_Col_Sens1.5), U_Sensors/Col_Sens2 (P4_Col_Sens2.5), U_Sensors/Col_Sens3 (P4_Col_Sens3.5), U_Sensors/Col_Sens4 (P4_Col_Sens4.5), U_Sensors/Col_Sens5 (P4_Col_Sens5.5), PIC32MK (uC.62)
S2: U_Sensors/Col_Sens1 (P4_Col_Sens1.6), U_Sensors/Col_Sens2 (P4_Col_Sens2.6), U_Sensors/Col_Sens3 (P4_Col_Sens3.6), U_Sensors/Col_Sens4 (P4_Col_Sens4.6), U_Sensors/Col_Sens5 (P4_Col_Sens5.6), PIC32MK (uC.2)
S3: U_Sensors/Col_Sens1 (P4_Col_Sens1.7), U_Sensors/Col_Sens2 (P4_Col_Sens2.7), U_Sensors/Col_Sens3 (P4_Col_Sens3.7), U_Sensors/Col_Sens4 (P4_Col_Sens4.7), U_Sensors/Col_Sens5 (P4_Col_Sens5.7), PIC32MK (uC.55)
~{SS}: Communication (J2.2), PIC32MK (uC.58)
SCK: Communication (J2.3), PIC32MK (uC.59)
SCL: Communication (I2C.3), PIC32MK (uC.32)
SDA: Communication (I2C.4), PIC32MK (uC.27)
SDI: Communication (J2.4), PIC32MK (uC.5)
SDO: Communication (J2.5), PIC32MK (uC.11)
TCK1: U_Sensors/Col_Sens1 (P4_Col_Sens1.3), PIC32MK (uC.1)
TCK2: U_Sensors/Col_Sens2 (P4_Col_Sens2.3), PIC32MK (uC.3)
TCK3: U_Sensors/Col_Sens3 (P4_Col_Sens3.3), PIC32MK (uC.61)
TCK4: U_Sensors/Col_Sens4 (P4_Col_Sens4.3), PIC32MK (uC.63)
TCK5: U_Sensors/Col_Sens5 (P4_Col_Sens5.3), PIC32MK (uC.60)
TX: Communication (J1.3), PIC32MK (uC.50)